# Altium schematic sheet Reference Voltage.SchDoc
size A4
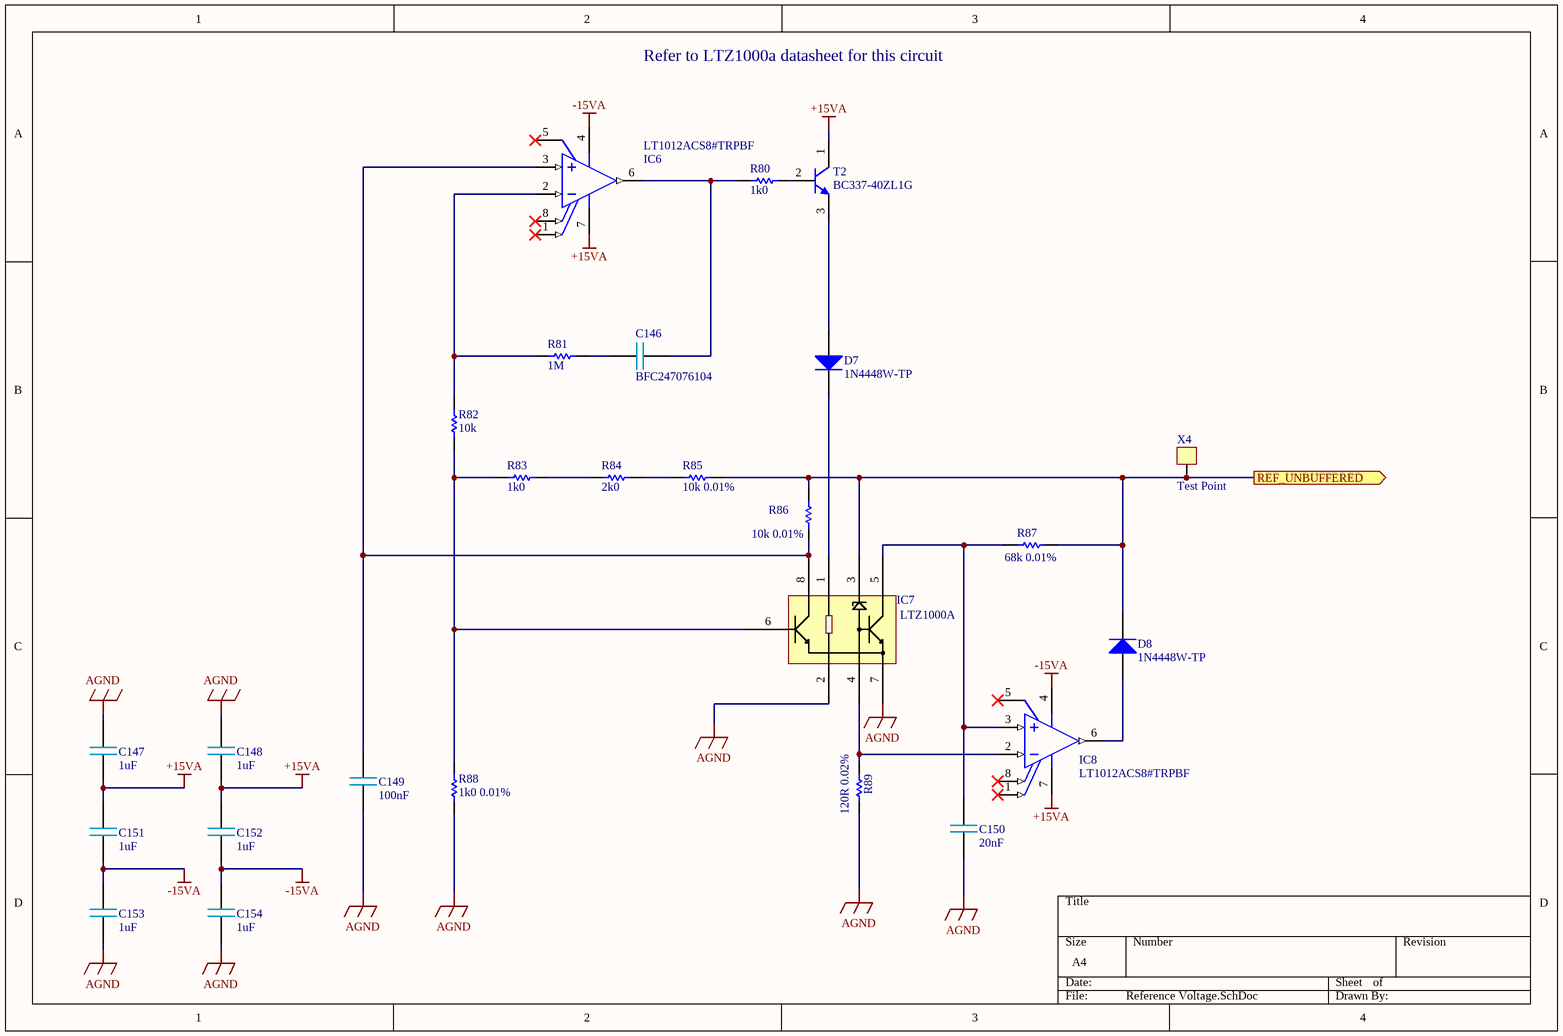
[diagram p0: Reference Voltage.SchDoc]

## Parts
C146  BFC247076104  [Cap 5mm polyester]
C147  1uF  [Capacitor 7mmx3mm 5mm pitch]
C148  1uF  [Capacitor 7mmx3mm 5mm pitch]
C149  100nF  [Cap 5mm polyester]
C150  20nF  [Cap 5mm polyester]
C151  1uF  [Capacitor 7mmx3mm 5mm pitch]
C152  1uF  [Capacitor 7mmx3mm 5mm pitch]
C153  1uF  [Capacitor 7mmx3mm 5mm pitch]
C154  1uF  [Capacitor 7mmx3mm 5mm pitch]
D7  1N4448W-TP  [MCC-SOD123_V]
D8  1N4448W-TP  [MCC-SOD123_V]
IC6  LT1012ACS8#TRPBF  [LT-S8-8_M]
IC7  LTZ1000A  [H-08A]
IC8  LT1012ACS8#TRPBF  [LT-S8-8_M]
R80  1k0  [RESC3116X65X40LL10T20]
R81  1M  [RESC0805(2012)_N]
R82  10k  [RESC3116X65X40LL10T20]
R83  1k0  [RESC0805(2012)_N]
R84  2k0  [RESC0805(2012)_N]
R85  10k 0.01%  [RESC3116X65X40LL10T20]
R86  10k 0.01%  [RESC3116X65X40LL10T20]
R87  68k 0.01%  [RESC3116X65X40LL10T20]
R88  1k0 0.01%  [RESC3116X65X40LL10T20]
R89  120R 0.02%  [RESC3116X65X40LL10T20]
T2  BC337-40ZL1G  [ONSC-TO-92-3-29-11_AM_BL]
X4  Test Point  [Test Point]

## Ports
REF_UNBUFFERED (out)

## Nets
+15VA: C147.2 C148.2 C151.1 C152.1 IC6.7(V+) IC8.7(V+) T2.1(C)
-15VA: C151.2 C152.2 C153.1 C154.1 IC6.4(V-) IC8.4(V-)
AGND: C147.1 C148.1 C149.1 C150.1 C153.2 C154.2 IC7.2 IC7.7 R88.1 R89.1
REF_UNBUFFERED: D8.2(K) IC7.3 R85.2 R86.2 R87.1 X4.1 ; port REF_UNBUFFERED
NetC146_1: C146.1 R81.2
NetC146_2: C146.2 IC6.6(OUT) R80.1
NetC149_2: C149.2 IC6.3(+IN) IC7.8 R86.1
NetC150_2: C150.2 IC7.5 IC8.3(+IN) R87.2
NetD7_1: D7.1(A) T2.3(E)
NetD7_2: D7.2(K) IC7.1
NetD8_1: D8.1(A) IC8.6(OUT)
NetIC6_2: IC6.2(-IN) R81.1 R82.1
NetIC7_4: IC7.4 IC8.2(-IN) R89.2
NetIC7_6: IC7.6 R82.2 R83.1 R88.2
NetR80_2: R80.2 T2.2(B)
NetR83_2: R83.2 R84.1
NetR84_2: R84.2 R85.1

Not connected (* = marked no-connect by the designer): IC6 1(VOS_TRIM)* 5(OVER_COMP)* 8(VOS_TRIM)*; IC8 1(VOS_TRIM)* 5(OVER_COMP)* 8(VOS_TRIM)*

## Notes on the sheet
- Refer to LTZ1000a datasheet for this circuit

## Library data of the parts
C147-C154 = BFC247076104
D7 D8 = CMP-0862-00001-1: Switching Diode, 500 mW, 100 V, -55 to 150 degC, SOD123, RoHS, Tape and Reel; Manufacturer: Micro Commercial Components; FV: 1 V Max.; Trr: 4 nS; IF (AV): 250 mA; VRM (PRV): 100 V; PD: 500 mW; Typical Junction Capacitance: 4 pF; IR: 25 nA; ComponentLink1Description: Manufacturer URL; PackageVersion: Rev. C; ComponentLink2URL: http://www.mccsemi.com/up_pdf/1N4448W(SOD-123).pdf; DatasheetVersion: Rev. C; ComponentLink3Description: Package Specification; PackageDescription: 2-Pin SOD123, Body 2.7 x 1.6 mm, Height 1.35 mm; ComponentLink3URL: http://www.mccsemi.com/up_pdf/1N4448W(SOD-123).pdf; Operating Temperature Range: -55 to 150 degC; PackageReference: SOD123; PartNumber: 1N4448W-TP; Packing: Tape and Reel; ComponentLink1URL: http://www.mccsemi.com/; RoHS: TRUE; ComponentLink2Description: Datasheet; Mounting Technology: Surface Mount
IC6 IC8 = CMP-0359-03028-2: Single Channel, Low Vos Stable Operational Amplifier, 1 MHz Typical GBW, 0.2 V/us Typical SR, 2.4 to 40 V, 8-Pin SOIC (S8-8), Commerical, Pb-Free, Reel; Linear Technology Part Number: LT1012; Manufacturer: Linear Technology; Channels (#): 1; Is (mA) Typical: 0.37; Vos (mV) Typical: 0.008; Vs Max (V): 40; SR (V/us) Typical: 0.2; Vs Min (V): 2.4; RoHS: Pb-Free; PackageVersion: Rev G; ComponentLink2Description: Datasheet; Mounting Technology: Surface Mount; Type: VFB; ComponentLink3Description: Package Specification; DatasheetVersion: Rev. B; RevisionNote: URLs updated; PackageDescription: 8-Pin Plastic Small Outline, Body 4.9 x 3.9 mm, Pitch 1.27 mm; Packing: Reel; GBW (MHz) Typical: 1; ComponentLink1Description: Manufacturer URL; ComponentLink1URL: http://www.linear.com/; ComponentLink3URL: http://cds.linear.com/docs/en/packaging/05081610_G_SO8.pdf; PartNumber: LT1012ACS8#TRPBF; ComponentLink2URL: http://cds.linear.com/docs/en/datasheet/1012afbs.pdf; PackageReference: LT-S8-8
R80 R82 R85-R89 = CMP-2003-03538-1: Manufacturer: Yageo; Part Number: RC1206FR-0710K2L
R81 R83 R84 = CMP-1013-00849-1: 1M 0.125W 1% 0805 (2012 Metric)  SMD; Value: 1000000.00 Ohm; Case-Metric: 2012; Case-EIA: 0805; Technology: SMT; Power: 0.125 W; Tolerance: 1 %
T2 = CMP-1048-01583-1: Amplifier Transistor, NPN Silicon, 3-Pin TO-92, Pb-Free, Ammo Box; Manufacturer: On Semiconductor; IC Continuous (A): 0.8; ComponentLink2URL: http://www.onsemi.com/pub_link/Collateral/BC337-D.PDF; PackageReference: TO-92-3-29-11_AM_BL; ComponentLink1Description: Manufacturer URL; PartNumber: BC337-40ZL1G; RoHS: TRUE; PackageVersion: Rev. AM; ComponentLink3URL: http://www.onsemi.com/pub_link/Collateral/MAC97-D.PDF; ComponentLink3Description: Package Specification; Packing: Ammo Box; DatasheetVersion: Rev. 8; Polarity: NPN; ComponentLink1URL: http://www.onsemi.com/; ComponentLink2Description: Datasheet; PackageDescription: 3-Pin Transistor Outline, Body 4.825 x 3.685 mm, Pitch 1.27 mm; Mounting Technology: Through Hole